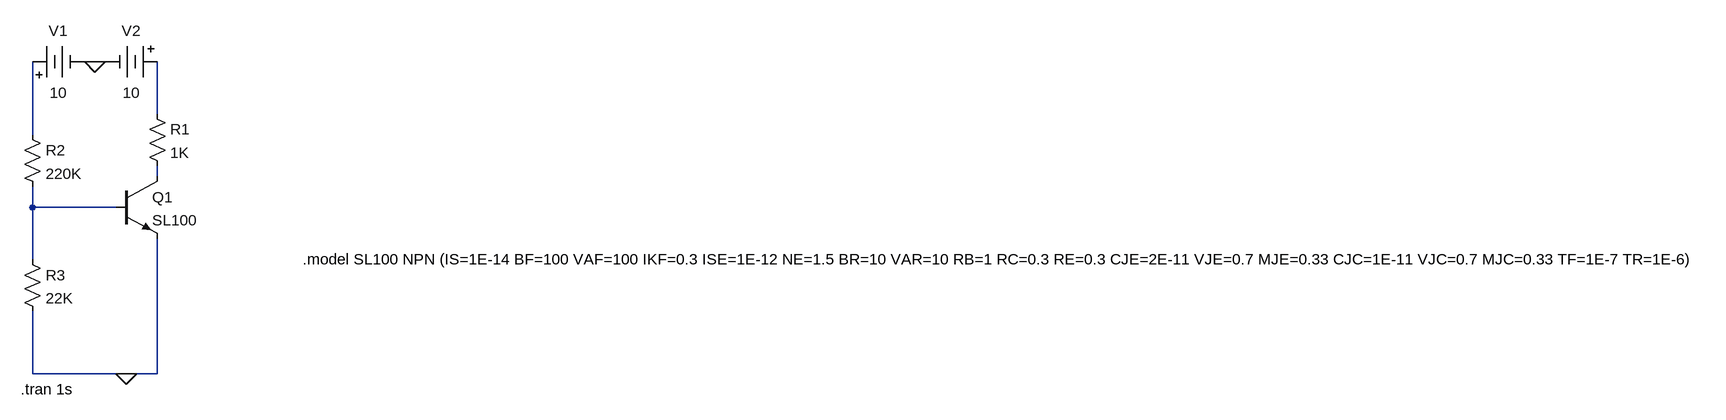
[diagram p0: schematic Draft1.asc]
Draft1.asc, the LTspice schematic file:
Version 4
SHEET 1 2716 680
WIRE 112 -80 96 -80
WIRE 128 -80 112 -80
WIRE 208 0 208 -80
WIRE 16 32 16 -80
WIRE 208 96 208 80
WIRE 16 144 16 112
WIRE 144 144 16 144
WIRE 16 224 16 144
WIRE 16 400 16 304
WIRE 160 400 16 400
WIRE 208 400 208 192
WIRE 208 400 160 400
FLAG 160 400 0
FLAG 112 -80 0
SYMBOL npn 144 96 R0
SYMATTR InstName Q1
SYMATTR Value SL100
SYMBOL res 192 -16 R0
SYMATTR InstName R1
SYMATTR Value 1K
SYMBOL res 0 16 R0
SYMATTR InstName R2
SYMATTR Value 220K
SYMBOL res 0 208 R0
SYMATTR InstName R3
SYMATTR Value 22K
SYMBOL Misc\\battery 0 -80 R270
WINDOW 0 32 56 VTop 2
WINDOW 3 -32 56 VBottom 2
WINDOW 123 0 0 Left 0
WINDOW 39 0 0 Left 0
SYMATTR InstName V1
SYMATTR Value 10
SYMBOL Misc\\battery 224 -80 R90
WINDOW 0 -32 56 VBottom 2
WINDOW 3 32 56 VTop 2
WINDOW 123 0 0 Left 0
WINDOW 39 0 0 Left 0
SYMATTR InstName V2
SYMATTR Value 10
TEXT 432 224 Left 2 !.model SL100 NPN (IS=1E-14 BF=100 VAF=100 IKF=0.3 ISE=1E-12 NE=1.5 BR=10 VAR=10 RB=1 RC=0.3 RE=0.3 CJE=2E-11 VJE=0.7 MJE=0.33 CJC=1E-11 VJC=0.7 MJC=0.33 TF=1E-7 TR=1E-6)
TEXT -2 424 Left 2 !.tran 1s

The netlist it stands for:
* Draft1.asc
Q1 N003 N004 0 0 SL100
R1 N001 N003 1K
R2 N002 N004 220K
R3 N004 0 22K
V1 N002 0 10
V2 N001 0 10
.model NPN NPN
.model PNP PNP
.lib standard.bjt
.model SL100 NPN (IS=1E-14 BF=100 VAF=100 IKF=0.3 ISE=1E-12 NE=1.5 BR=10 VAR=10 RB=1 RC=0.3 RE=0.3 CJE=2E-11 VJE=0.7 MJE=0.33 CJC=1E-11 VJC=0.7 MJC=0.33 TF=1E-7 TR=1E-6)
.tran 1s
.backanno
.end